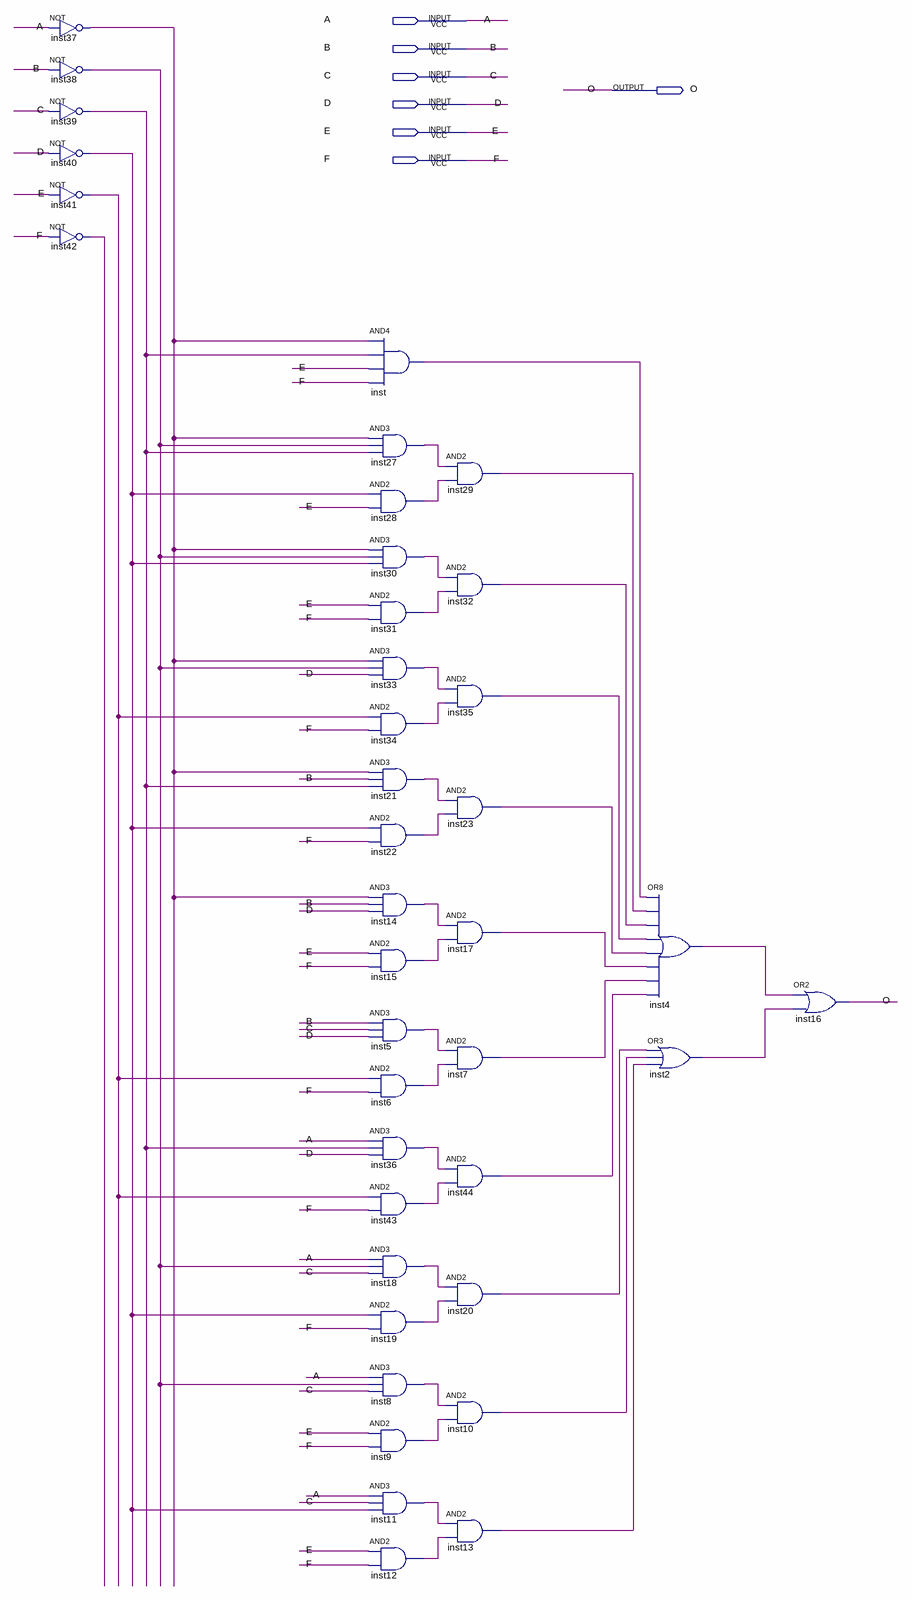
[diagram p0: schematic sheet]
// Quartus schematic primeExtension.bdf as structural Verilog: 40 symbols, 7 pins
module primeExtension (
  input  A,
  input  B,
  input  C,
  input  D,
  input  E,
  input  F,
  output O
);

  wire inst2_out, inst4_out, inst5_out, inst6_out, inst7_out, inst8_out, inst9_out, inst10_out, inst11_out,
       inst12_out, inst13_out, inst14_out, inst15_out, inst17_out, inst18_out, inst19_out, inst20_out,
       inst21_out, inst22_out, inst23_out, inst27_out, inst28_out, inst29_out, inst30_out, inst31_out,
       inst32_out, inst33_out, inst34_out, inst35_out, inst36_out, inst37_out, inst38_out, inst39_out,
       inst40_out, inst41_out, inst42_out, inst43_out, inst44_out, inst_out;

  not inst37 (inst37_out, A);
  not inst38 (inst38_out, B);
  not inst39 (inst39_out, C);
  not inst40 (inst40_out, D);
  not inst41 (inst41_out, E);
  not inst42 (inst42_out, F);
  and inst (inst_out, inst37_out, inst39_out, E, F);
  and inst27 (inst27_out, inst37_out, inst38_out, inst39_out);
  and inst28 (inst28_out, inst40_out, E);
  and inst30 (inst30_out, inst37_out, inst38_out, inst40_out);
  and inst31 (inst31_out, E, F);
  and inst33 (inst33_out, inst37_out, inst38_out, D);
  and inst34 (inst34_out, inst41_out, F);
  and inst21 (inst21_out, inst37_out, B, inst39_out);
  and inst22 (inst22_out, inst40_out, F);
  and inst14 (inst14_out, inst37_out, B, D);
  and inst15 (inst15_out, E, F);
  and inst5 (inst5_out, B, C, D);
  and inst6 (inst6_out, inst41_out, F);
  and inst36 (inst36_out, A, inst39_out, D);
  and inst43 (inst43_out, inst41_out, F);
  and inst18 (inst18_out, A, inst38_out, C);
  and inst19 (inst19_out, inst40_out, F);
  and inst8 (inst8_out, A, inst38_out, C);
  and inst9 (inst9_out, E, F);
  and inst11 (inst11_out, A, C, inst40_out);
  and inst12 (inst12_out, E, F);
  and inst29 (inst29_out, inst27_out, inst28_out);
  and inst32 (inst32_out, inst30_out, inst31_out);
  and inst35 (inst35_out, inst33_out, inst34_out);
  and inst23 (inst23_out, inst21_out, inst22_out);
  and inst17 (inst17_out, inst14_out, inst15_out);
  and inst7 (inst7_out, inst5_out, inst6_out);
  and inst44 (inst44_out, inst36_out, inst43_out);
  and inst20 (inst20_out, inst18_out, inst19_out);
  and inst10 (inst10_out, inst8_out, inst9_out);
  and inst13 (inst13_out, inst11_out, inst12_out);
  or inst4 (inst4_out, inst_out, inst29_out, inst32_out, inst35_out, inst23_out, inst17_out, inst7_out, inst44_out);
  or inst2 (inst2_out, inst20_out, inst10_out, inst13_out);
  or inst16 (O, inst4_out, inst2_out);
endmodule
